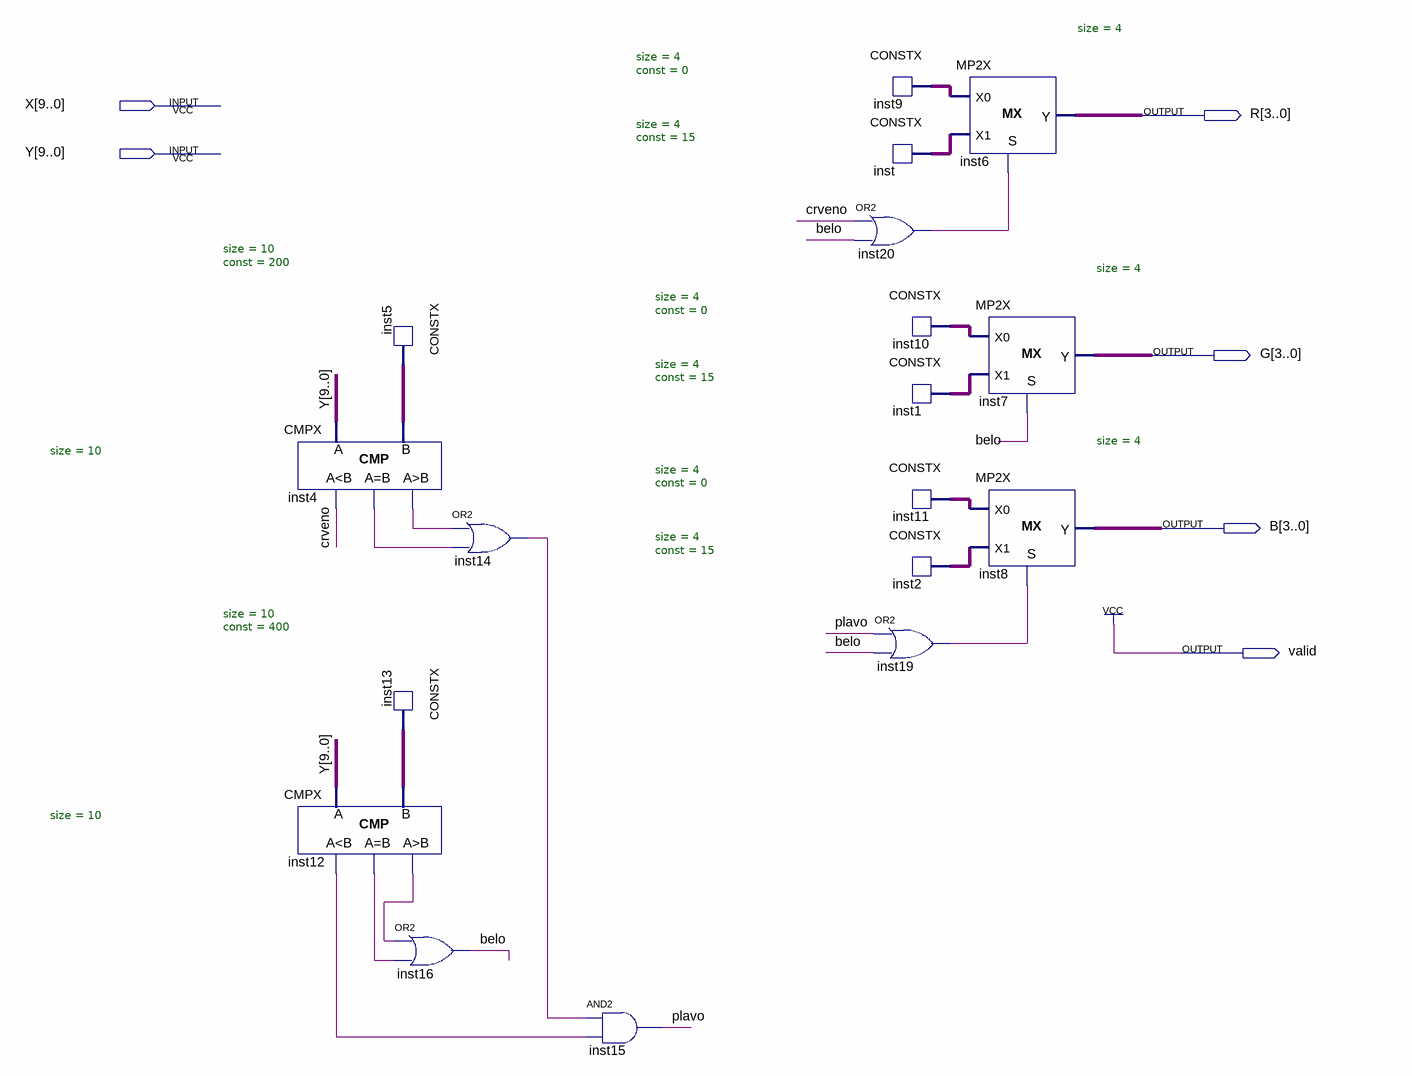
[diagram p0: schematic sheet]
// Quartus schematic Srbija.bdf as structural Verilog: 18 symbols, 6 pins
module Srbija (
  input  [9:0] X,
  input  [9:0] Y,
  output [3:0] R,
  output [3:0] G,
  output [3:0] B,
  output valid
);

  wire belo, crveno, inst4_eq, inst4_gr, inst12_eq, inst12_gr, inst12_ls, inst14_out, inst19_out, inst20_out,
       plavo;
  wire [3:0] inst1_data, inst2_data, inst9_data, inst10_data, inst11_data, inst_data;
  wire [9:0] inst5_data, inst13_data;

  CMPX #(.size(10)) inst4 (.A(Y), .B(inst5_data), .ls(crveno), .eq(inst4_eq), .gr(inst4_gr));
  CMPX #(.size(10)) inst12 (.A(Y), .B(inst13_data), .ls(inst12_ls), .eq(inst12_eq), .gr(inst12_gr));
  CONSTX #(.size(10), .\const (200)) inst5 (.data(inst5_data));
  CONSTX #(.size(10), .\const (400)) inst13 (.data(inst13_data));
  or inst16 (belo, inst12_gr, inst12_eq);
  or inst14 (inst14_out, inst4_gr, inst4_eq);
  and inst15 (plavo, inst14_out, inst12_ls);
  CONSTX #(.size(4), .\const (0)) inst9 (.data(inst9_data));
  CONSTX #(.size(4), .\const (15)) inst (.data(inst_data));
  or inst20 (inst20_out, crveno, belo);
  CONSTX #(.size(4), .\const (0)) inst10 (.data(inst10_data));
  CONSTX #(.size(4), .\const (15)) inst1 (.data(inst1_data));
  CONSTX #(.size(4), .\const (0)) inst11 (.data(inst11_data));
  CONSTX #(.size(4), .\const (15)) inst2 (.data(inst2_data));
  or inst19 (inst19_out, plavo, belo);
  MP2X #(.size(4)) inst6 (.S(inst20_out), .X0(inst9_data), .X1(inst_data), .Y(R));
  MP2X #(.size(4)) inst7 (.S(belo), .X0(inst10_data), .X1(inst1_data), .Y(G));
  MP2X #(.size(4)) inst8 (.S(inst19_out), .X0(inst11_data), .X1(inst2_data), .Y(B));

  assign valid = 1'b1;
endmodule
